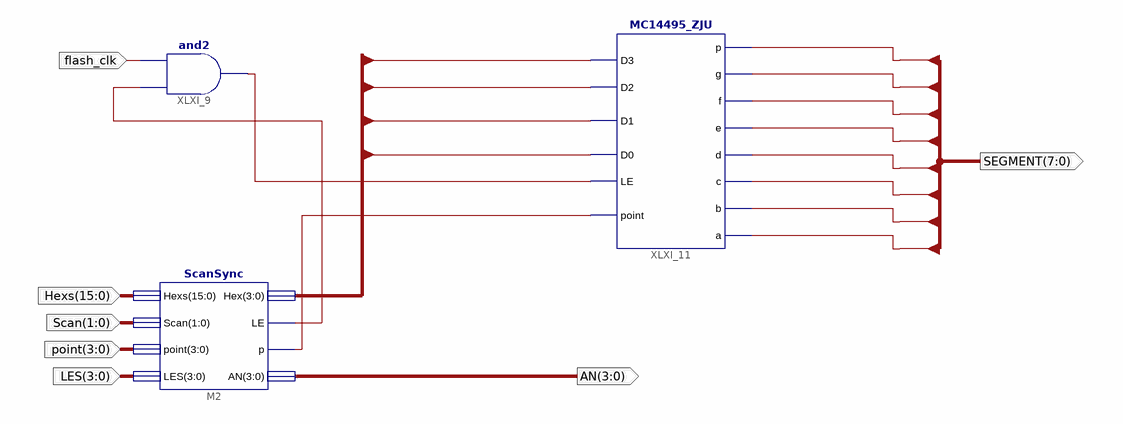
[diagram p0: schematic sheet 1]
// Xilinx ISE schematic Seg7_Dev16.sch (kintex7) as structural Verilog: 3 symbols, 7 ports
module Seg7_Dev16 (
  input  [1:0] Scan,
  input  [3:0] point,
  input  [3:0] LES,
  input  [15:0] Hexs,
  input  flash_clk,
  output [3:0] AN,
  output [7:0] SEGMENT
);

  wire XLXN_33, XLXN_36, XLXN_37;
  wire [3:0] Hex;

  ScanSync M2 (.Hexs(Hexs), .Scan(Scan), .point(point), .LES(LES), .Hex(Hex), .LE(XLXN_33), .p(XLXN_37), .AN(AN));
  and XLXI_9 (XLXN_36, XLXN_33, flash_clk);
  MC14495_ZJU XLXI_11 (
    .LE(XLXN_36), .point(XLXN_37), .p(SEGMENT[7]), .g(SEGMENT[6]), .f(SEGMENT[5]), .e(SEGMENT[4]),
    .d(SEGMENT[3]), .c(SEGMENT[2]), .b(SEGMENT[1]), .a(SEGMENT[0]), .D1(Hex[1]), .D0(Hex[0]), .D2(Hex[2]),
    .D3(Hex[3]));
endmodule
